# Altium schematic sheet 1_CAN_USB_MCU_Power.SchDoc: Title
size 420 x 297 mm; Address1: Address1; Address2: Address2; Address3: Address3; Address4: Address4; SheetNumber: 1; Scale: 1:1; Title2str: Title2str; DocumentType: Схема электрическая принципиальная
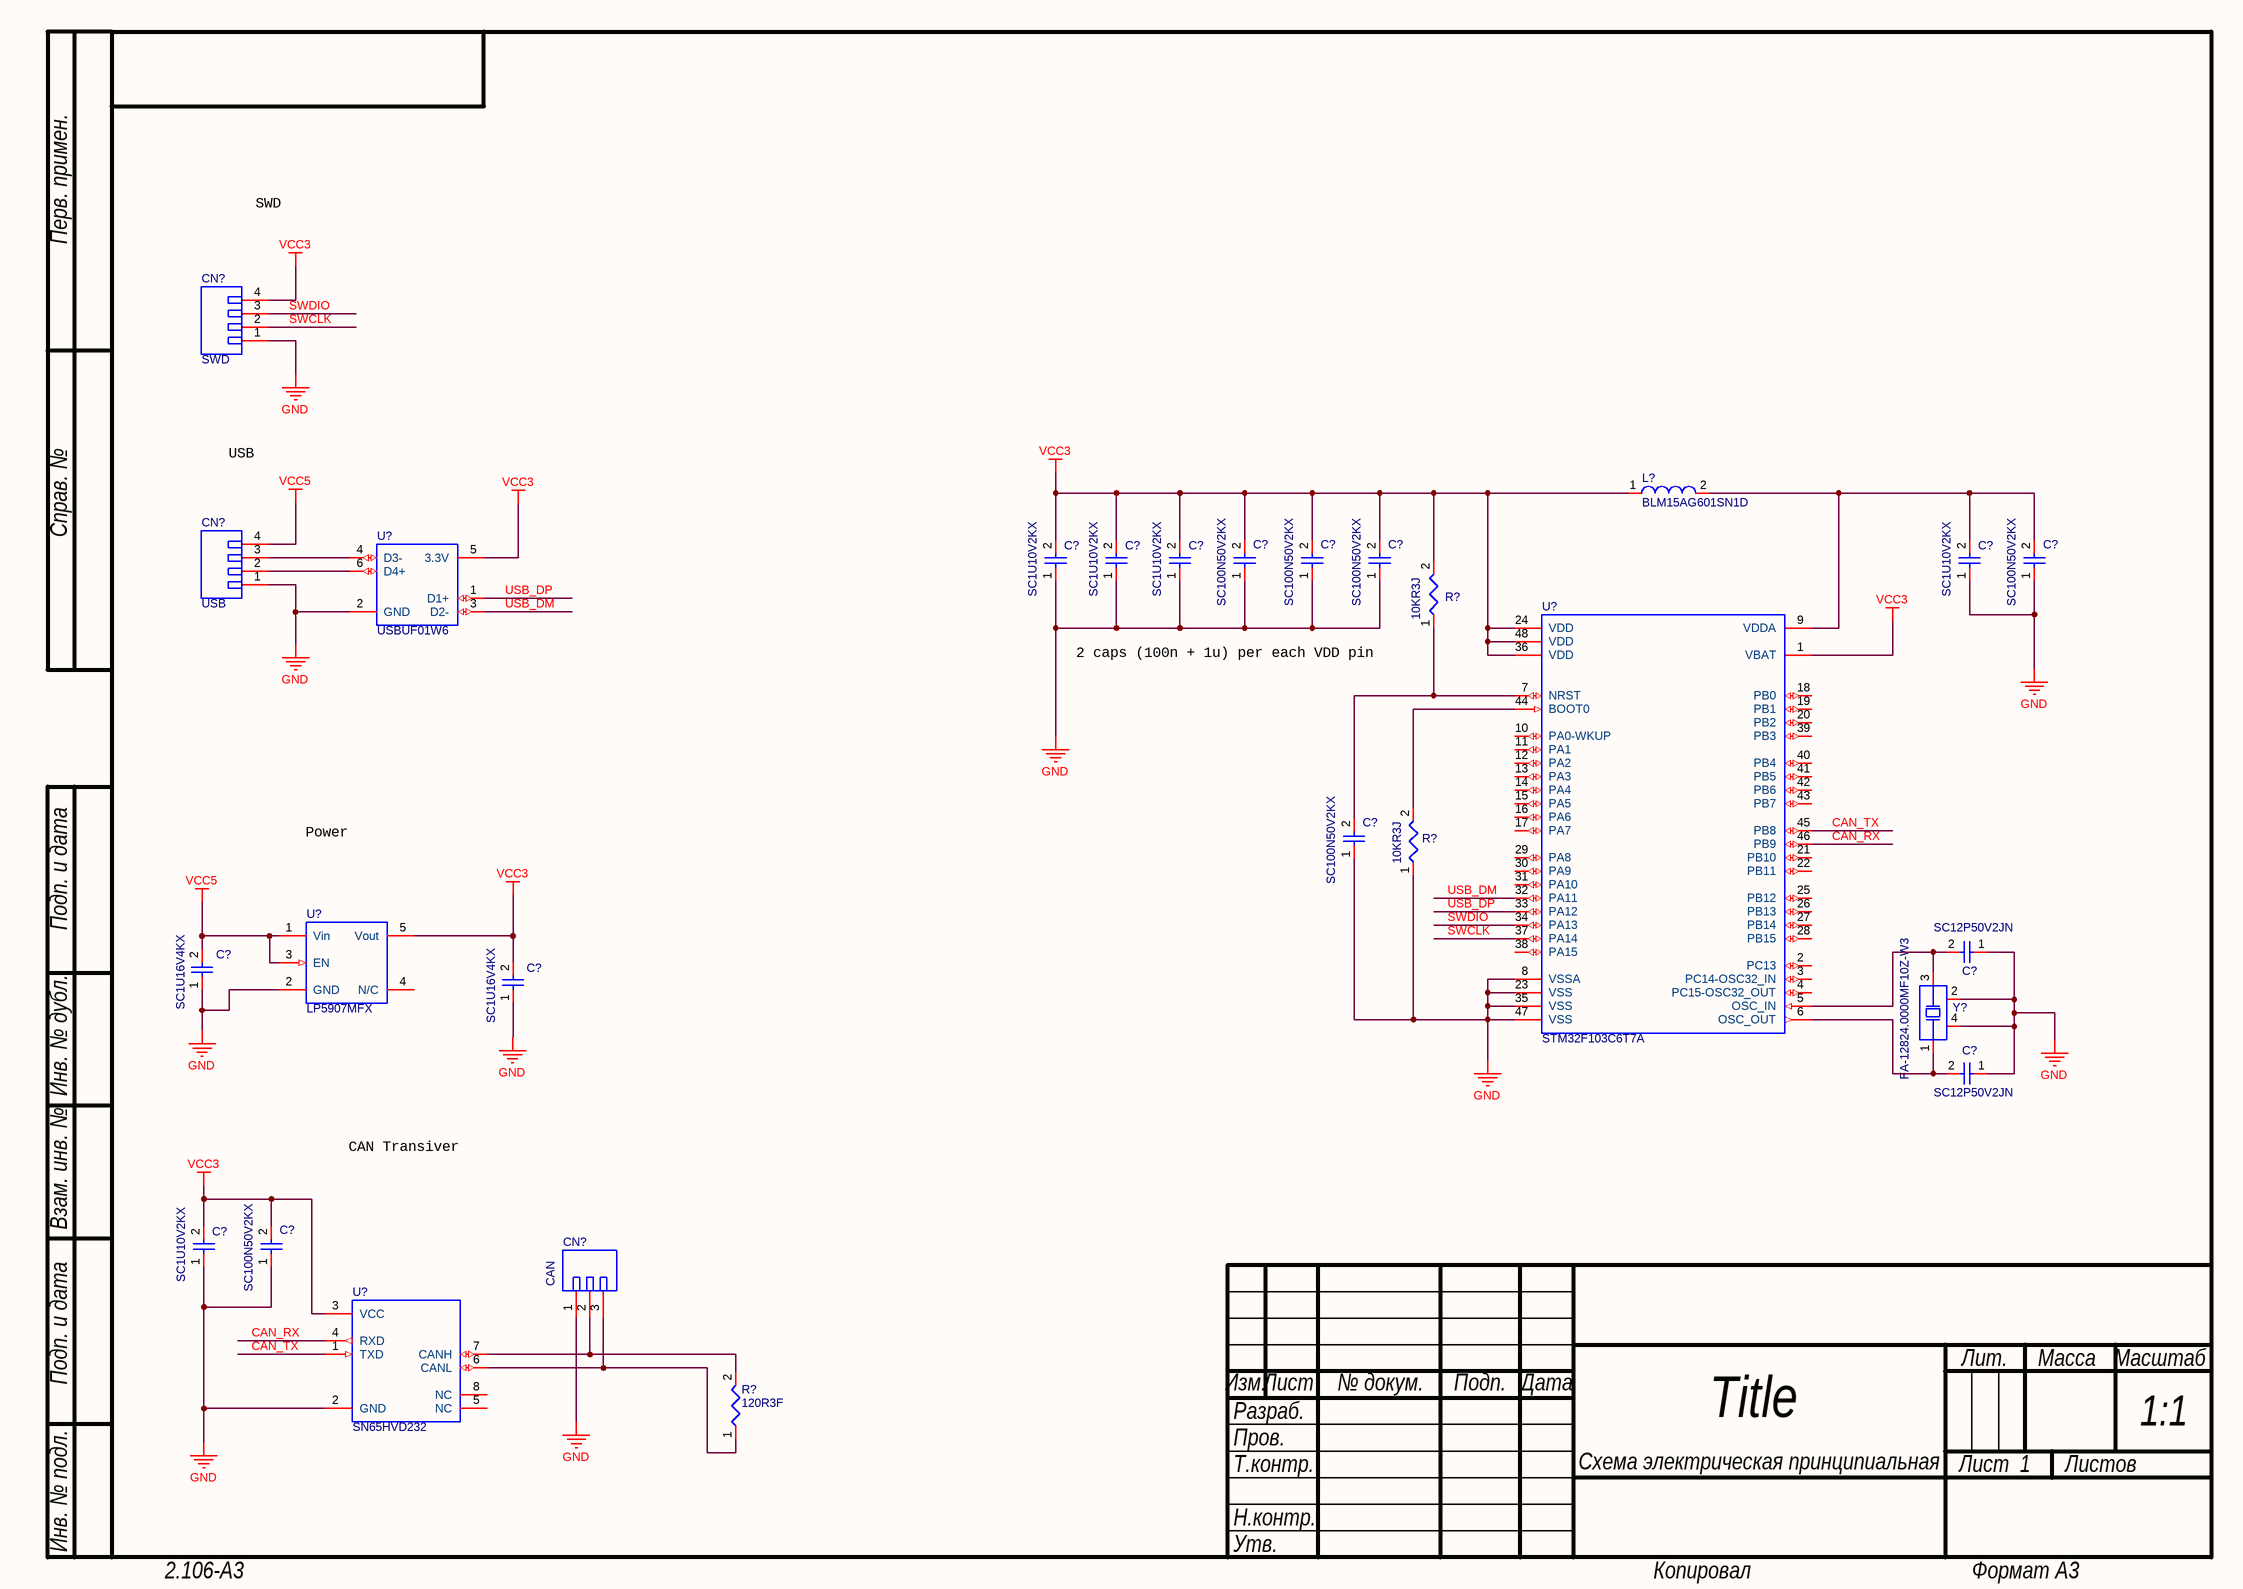
[diagram p0: 1_CAN_USB_MCU_Power.SchDoc]

## Parts
(Parts that share a designator on the sheet are numbered #1, #2 ... from top to bottom, then left to right.)
C?#1  SC1U10V2KX  [CAPC0402(1005)60_L]
C?#2  SC1U10V2KX  [CAPC0402(1005)60_L]
C?#3  SC1U10V2KX  [CAPC0402(1005)60_L]
C?#4  SC100N50V2KX  [CAPC0402(1005)60_L]
C?#5  SC100N50V2KX  [CAPC0402(1005)60_L]
C?#6  SC100N50V2KX  [CAPC0402(1005)60_L]
C?#7  SC1U10V2KX  [CAPC0402(1005)60_L]
C?#8  SC100N50V2KX  [CAPC0402(1005)60_L]
C?#9  SC100N50V2KX  [CAPC0402(1005)60_L]
C?#10  SC12P50V2JN  [CAPC0402(1005)33_L]
C?#11  SC1U16V4KX  [CAPC0805(2012)145_L]
C?#12  SC1U16V4KX  [CAPC0805(2012)145_L]
C?#13  SC12P50V2JN  [CAPC0402(1005)33_L]
C?#14  SC1U10V2KX  [CAPC0402(1005)60_L]
C?#15  SC100N50V2KX  [CAPC0402(1005)60_L]
CN?#1  SWD  [4PHEADERS-2D54]
CN?#2  USB  [4PHEADERS-2D54]
CN?#3  CAN  [3PHEADERS-2D54]
L?  BLM15AG601SN1D  [INDC1005X06L]
R?#1  10KR3J  [RESC0603(1608)_L]
R?#2  10KR3J  [RESC0603(1608)_L]
R?#3  120R3F  [RESC0603(1608)_L]
U?#1  USBUF01W6  [SOT323-6L]
U?#2  STM32F103C6T7A  [TSQFP50P900X900X160-48L]
U?#3  LP5907MFX  [SOT95P280X145-5L]
U?#4  SN65HVD232  [SOIC127P600X175-8L]
Y?  FA-12824.0000MF10Z-W3  [QRTZ-12mhz]

## Nets
GND: C?#1.1 C?#2.1 C?#3.1 C?#4.1 C?#5.1 C?#6.1 C?#7.1 C?#8.1 C?#9.1 C?#10.1 C?#11.1 C?#12.1 C?#13.1 C?#14.1 C?#15.1 CN?#1.1 CN?#2.1 CN?#3.1 R?#2.1 U?#1.2(GND) U?#2.8(VSSA) U?#2.23(VSS) U?#2.35(VSS) U?#2.47(VSS) U?#3.2(GND) U?#4.2(GND) Y?.2(NC) Y?.4(NC)
VCC3: C?#1.2 C?#2.2 C?#3.2 C?#4.2 C?#5.2 C?#6.2 C?#12.2 C?#14.2 C?#15.2 CN?#1.4 L?.1 R?#1.2 U?#1.5(3.3V) U?#2.1(VBAT) U?#2.24(VDD) U?#2.36(VDD) U?#2.48(VDD) U?#3.5(Vout) U?#4.3(VCC)
VCC5: C?#11.2 CN?#2.4 U?#3.1(Vin) U?#3.3(EN)
CAN_RX: U?#2.46(PB9) U?#4.4(RXD)
CAN_TX: U?#2.45(PB8) U?#4.1(TXD)
SWCLK: CN?#1.2 U?#2.37(PA14)
SWDIO: CN?#1.3 U?#2.34(PA13)
USB_DM: U?#1.3(D2-) U?#2.32(PA11)
USB_DP: U?#1.1(D1+) U?#2.33(PA12)
NetC?#7_2: C?#7.2 C?#8.2 L?.2 U?#2.9(VDDA)
NetC?#9_2: C?#9.2 R?#1.1 U?#2.7(NRST)
NetC?#10_2: C?#10.2 U?#2.5(OSC_IN) Y?.3(X2)
NetC?#13_2: C?#13.2 U?#2.6(OSC_OUT) Y?.1(X1)
NetCN?#2_2: CN?#2.2 U?#1.6(D4+)
NetCN?#2_3: CN?#2.3 U?#1.4(D3-)
NetCN?#3_2: CN?#3.2 R?#3.2 U?#4.7(CANH)
NetCN?#3_3: CN?#3.3 R?#3.1 U?#4.6(CANL)
NetR?#2_2: R?#2.2 U?#2.44(BOOT0)

Not connected (* = marked no-connect by the designer): U?#2 2(PC13) 3(PC14-OSC32_IN) 4(PC15-OSC32_OUT) 10(PA0-WKUP) 11(PA1) 12(PA2) 13(PA3) 14(PA4) 15(PA5) 16(PA6) 17(PA7) 18(PB0) 19(PB1) 20(PB2) 21(PB10) 22(PB11) 25(PB12) 26(PB13) 27(PB14) 28(PB15) 29(PA8) 30(PA9) 31(PA10) 38(PA15) 39(PB3) 40(PB4) 41(PB5) 42(PB6) 43(PB7); U?#3 4(N/C); U?#4 5(NC) 8(NC)

## Notes on the sheet
- SWD
- USB
- 2 caps (100n + 1u) per each VDD pin
- Power
- CAN Transiver
- Перв. примен.
- Справ. №
- Подп. и дата
- Инв. № дубл.
- Взам. инв. №
- Разраб.
- Изм.
- Лист
- № докум.
- Подп.
- Дата
- Лит.
- Масса
- Масштаб
- Пров.
- Т.контр.
- Листов
- Инв. № подл.
- Утв.
- Н.контр.
- 2.106-A3
- Копировал
- Формат А3

## Library data of the parts
C?#1-C?#3 C?#7 C?#14 = CAP(0402)1UF10V: CAP 1uF 10V ±10% 0402 (1005 Metric) Thickness 0.6mm SMD
C?#4-C?#6 C?#8 C?#9 C?#15 = CAP(0402)100nF50V: CAP 100nF 50V ±10% 0402 (1005 Metric) Thickness 0.6mm SMD
C?#10 C?#13 = CAP12pF: CAP 12pF 50V ±5% 0402 (1005 Metric) Thickness 0.33mm SMD
C?#11 C?#12 = CAP(0805)1UF16V: CAP 1uF 16V ±10% 0805(1610 Metric) Thickness 0.6mm SMD
CN?#1 CN?#2 = 4PIN-CN: 4 holes for 18awg wire; Manufacturer: JST; Datasheet URL: http://www.jst-mfg.com/product/pdf/eng/eGH.pdf; Package Reference: JST-BM04B-GHS-TBT
CN?#3 = 3PIN-CN: 3 holes for 18awg wire; Manufacturer: JST; Datasheet URL: http://www.jst-mfg.com/product/pdf/eng/eGH.pdf; Package Reference: JST-BM04B-GHS-TBT
L? = IND-filt: Chip Ferrite Bead Single Type 600 Ohms 300mA
R?#1 R?#2 = RES0(0603)_10K: 10K 0.1W 5% 0603 (1608 Metric)  SMD
R?#3 = RES0(0603)_120R: 120R 0.1W 1% 0603 (1608 Metric)  SMD
U?#2 = STM32F103C6T7A: ARM® Cortex®-M3 STM32F1 Microcontroller IC 32-Bit 72MHz 32KB 48-LFQP (7x7); Supply Voltage(Vcc) min (V): 2; FLASH Size (Prog) (kB): 512; Operating Frequency(F) (Processor speed) (MHz): 80; Internal RAM Size (kB): 160; Packing: Tape and Reel; Core: ARM Cortex-M4; I/Os: 38; Case/Package: UFQFN-48; RoHS Compliant: Yes; Mounting Technology: Surface Mount; ComponentLink1Description: Manufacturer URL; ComponentLink1URL: http://www.st.com/; Package Reference: UFQFPN48; ComponentLink2Description: Datasheet; ComponentLink2URL: http://www.st.com/st-web-ui/static/active/en/resource/technical/document/datasheet/CD00161566.pdf; Package Description: 48-Pin Ultra Thin Fine Pitch Quad Flat No-Lead, 7 x 7 x 0.6 mm Body, 0.5 mm Pitch, Exposed Pad
U?#3 = LP5907V3.3: 3.3V 250mA
U?#4 = CAN_SN65HVD232D: IC CAN TRANSCEIVER 8-SOIC
Y? = XTAL-1-3-4: Crystal, 24 MHz, +/- 10 ppm, -20 to 75 degC, 4-Pin SMD, RoHS, Tape and Reel; Frequency Tolerance: 10ppm; Load Capacitance: 12pF; Frequency: 24MHz; ESR (Equivalent Series Resistance): 80R; Length: 0.079inch; Frequency Stability: 10ppm; Width: 0.063inch; Mounting Technology: SMT; Tolerance: 10ppm; RoHS Compliant: Yes; Termination: SMD/SMT; Number of Pins: 4; Package Quantity: 250; Max Operating Temperature: 75°C; Packaging: Tape and Reel; Radiation Hardening: No; Mount: Surface Mount; Lead Free: Lead Free; Case/Package: SMD/SMT; Height: 0.02inch; Min Operating Temperature: -20°C